# Altium schematic sheet Main_6.SchDoc
size 330 x 199 mm; SheetNumber: 9; SheetTotal: 12
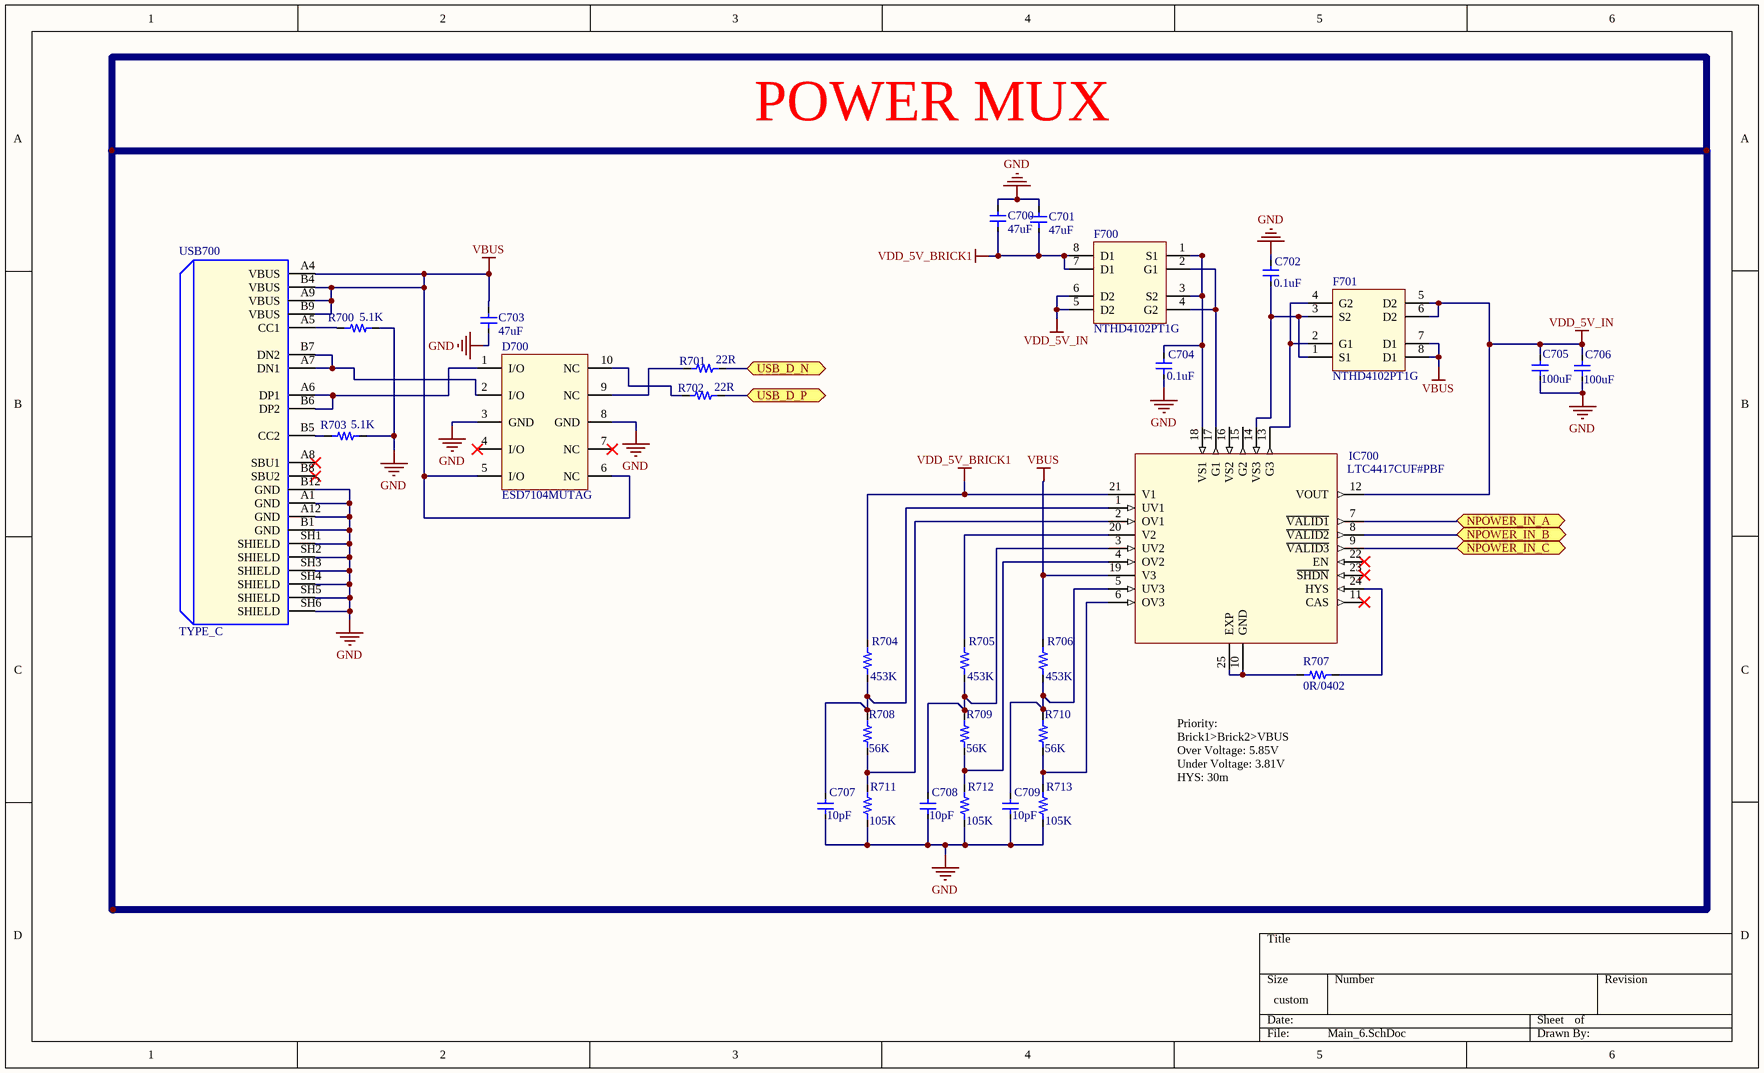
[diagram p0: Main_6.SchDoc]

## Parts
C700  47uF  [C0805]
C701  47uF  [C0805]
C702  0.1uF  [C0603]
C703  47uF  [C0805]
C704  0.1uF  [C0603]
C705  100uF  [C1206]
C706  100uF  [C1206]
C707  10pF  [C0603]
C708  10pF  [C0603]
C709  10pF  [C0603]
D700  ESD7104MUTAG  [UDFN10 2.5x1, 0.5P]
F700  NTHD4102PT1G  [NTHD4102PT1G]
F701  NTHD4102PT1G  [NTHD4102PT1G]
IC700  LTC4417CUF#PBF  [24QFN]
R700  5.1K  [R0402]
R701  22R  [R0402]
R702  22R  [R0402]
R703  5.1K  [R0402]
R704  453K  [R0402]
R705  453K  [R0402]
R706  453K  [R0402]
R707  0R/0402  [C0402]
R708  56K  [R0402]
R709  56K  [R0402]
R710  56K  [R0402]
R711  105K  [R0402]
R712  105K  [R0402]
R713  105K  [R0402]
USB700  TYPE_C  [2337857-1]

## Ports
NPOWER_IN_A (bidir), NPOWER_IN_B (bidir), NPOWER_IN_C (bidir), USB_D_N (bidir), USB_D_P (bidir)

## Nets
GND: C700.2 C701.2 C702.2 C703.1 C704.1 C705.1 C706.1 C707.1 C708.1 C709.1 D700.3(GND) D700.8(GND) R700.2 R703.2 R711.1 R712.1 R713.1 USB700.A1(GND) USB700.A12(GND) USB700.B1(GND) USB700.B12(GND) USB700.SH1(SHIELD) USB700.SH2(SHIELD) USB700.SH3(SHIELD) USB700.SH4(SHIELD) USB700.SH5(SHIELD) USB700.SH6(SHIELD)
VBUS: C703.2 D700.5(I/O) D700.6(NC) F701.7(D1) F701.8(D1) IC700.19(V3) R706.2 USB700.A4(VBUS) USB700.A9(VBUS) USB700.B4(VBUS) USB700.B9(VBUS)
VDD_5V_BRICK1: C700.1 C701.1 F700.7(D1) F700.8(D1) IC700.21(V1) R704.2
VDD_5V_IN: C705.2 C706.2 F700.5(D2) F700.6(D2) F701.5(D2) F701.6(D2) IC700.12(VOUT)
NPOWER_IN_A: IC700.7(~{VALID1}) ; port NPOWER_IN_A
NPOWER_IN_B: IC700.8(~{VALID2}) ; port NPOWER_IN_B
NPOWER_IN_C: IC700.9(~{VALID3}) ; port NPOWER_IN_C
USB_D_N: R701.2 ; port USB_D_N
USB_D_P: R702.2 ; port USB_D_P
NetC702_1: C702.1 F701.1(S1) F701.3(S2) IC700.14(VS3)
NetC704_2: C704.2 F700.1(S1) F700.3(S2) IC700.18(VS1)
NetC707_2: C707.2 IC700.1(UV1) R704.1 R708.2
NetC708_2: C708.2 IC700.3(UV2) R705.1 R709.2
NetC709_2: C709.2 IC700.5(UV3) R706.1 R710.2
NetD700_1: D700.1(I/O) USB700.A6(DP1) USB700.B6(DP2)
NetD700_2: D700.2(I/O) USB700.A7(DN1) USB700.B7(DN2)
NetD700_9: D700.9(NC) R701.1
NetD700_10: D700.10(NC) R702.1
NetF700_2: F700.2(G1) F700.4(G2) IC700.17(G1)
NetF701_2: F701.2(G1) F701.4(G2) IC700.13(G3)
NetIC700_2: IC700.2(OV1) R708.1 R711.2
NetIC700_4: IC700.4(OV2) R709.1 R712.2
NetIC700_6: IC700.6(OV3) R710.1 R713.2
NetIC700_10: IC700.10(GND) IC700.25(EXP) R707.1
NetIC700_20: IC700.20(V2) R705.2
NetIC700_24: IC700.24(HYS) R707.2
NetR700_1: R700.1 USB700.A5(CC1)
NetR703_1: R703.1 USB700.B5(CC2)

Not connected (* = marked no-connect by the designer): D700 4(I/O)* 7(NC)*; IC700 11(CAS)* 15(G2) 16(VS2) 22(EN)* 23(~{SHDN})*; USB700 A8(SBU1)* B8(SBU2)*

## Notes on the sheet
- POWER MUX
- (near R707) Priority: Brick1>Brick2>VBUS
  Over Voltage: 5.85V
  Under Voltage: 3.81V
  HYS: 30m

## Library data of the parts
C700 C701 C703 = GRM21BR61A476ME15L: 47 µF ±20% 10V Ceramic Capacitor X5R 0805 (2012 Metric)
C702 C704 = CC0603KRX7R8BB104: CAP CER 0.1UF 25V X7R 0603
C705 C706 = CC1206MKX5R5BB107: 100 µF ±20% 6.3V Ceramic Capacitor X5R 1206 (3216 Metric)
C707-C709 = CC0603JRNPO8BN100: 10 pF ±5% 25V Ceramic Capacitor C0G, NP0 0603 (1608 Metric)
D700 = ESD7104MUTAG: TVS DIODE 5VWM 10VC 10UDFN
F700 F701 = NTHD4102PT1G: MOSFET 2P-CH 20V 2.9A CHIPFET
IC700 = LTC4417CUF#PBF: IC OR CTRLR SRC SELECT 24QFN
R700 R703 = RC0402FR-135K1L: Thick Film Resistors - SMD 5.1kOhms 1/16W 0402 1%
R701 R702 = RC0402FR-0722RL: 22 Ohms ±1% 0.063W, 1/16W Chip Resistor 0402 (1005 Metric) Moisture Resistant Thick Film
R704-R706 = RC0402FR-07453KL: 453 kOhms ±1% 0.063W, 1/16W Chip Resistor 0402 (1005 Metric) Moisture Resistant Thick Film
R707 = CR0402AJ/-000GAS: 0 Ohms Jumper Chip Resistor 0402 (1005 Metric) Anti-Sulfur, Automotive AEC-Q200, Moisture Resistant Thick Film
R708-R710 = RC0402FR-1356KL: 56 kOhms ±1% 0.063W, 1/16W Chip Resistor 0402 (1005 Metric) Thick Film
R711-R713 = RC0402FR-07105KL: 105 kOhms ±1% 0.063W, 1/16W Chip Resistor 0402 (1005 Metric) Moisture Resistant Thick Film
USB700 = 2337857-1: VERTICAL USB TYPE-C REC